# Altium schematic sheet ProPatch Main.SchDoc
size C; SheetNumber: 1; SheetTotal: 1
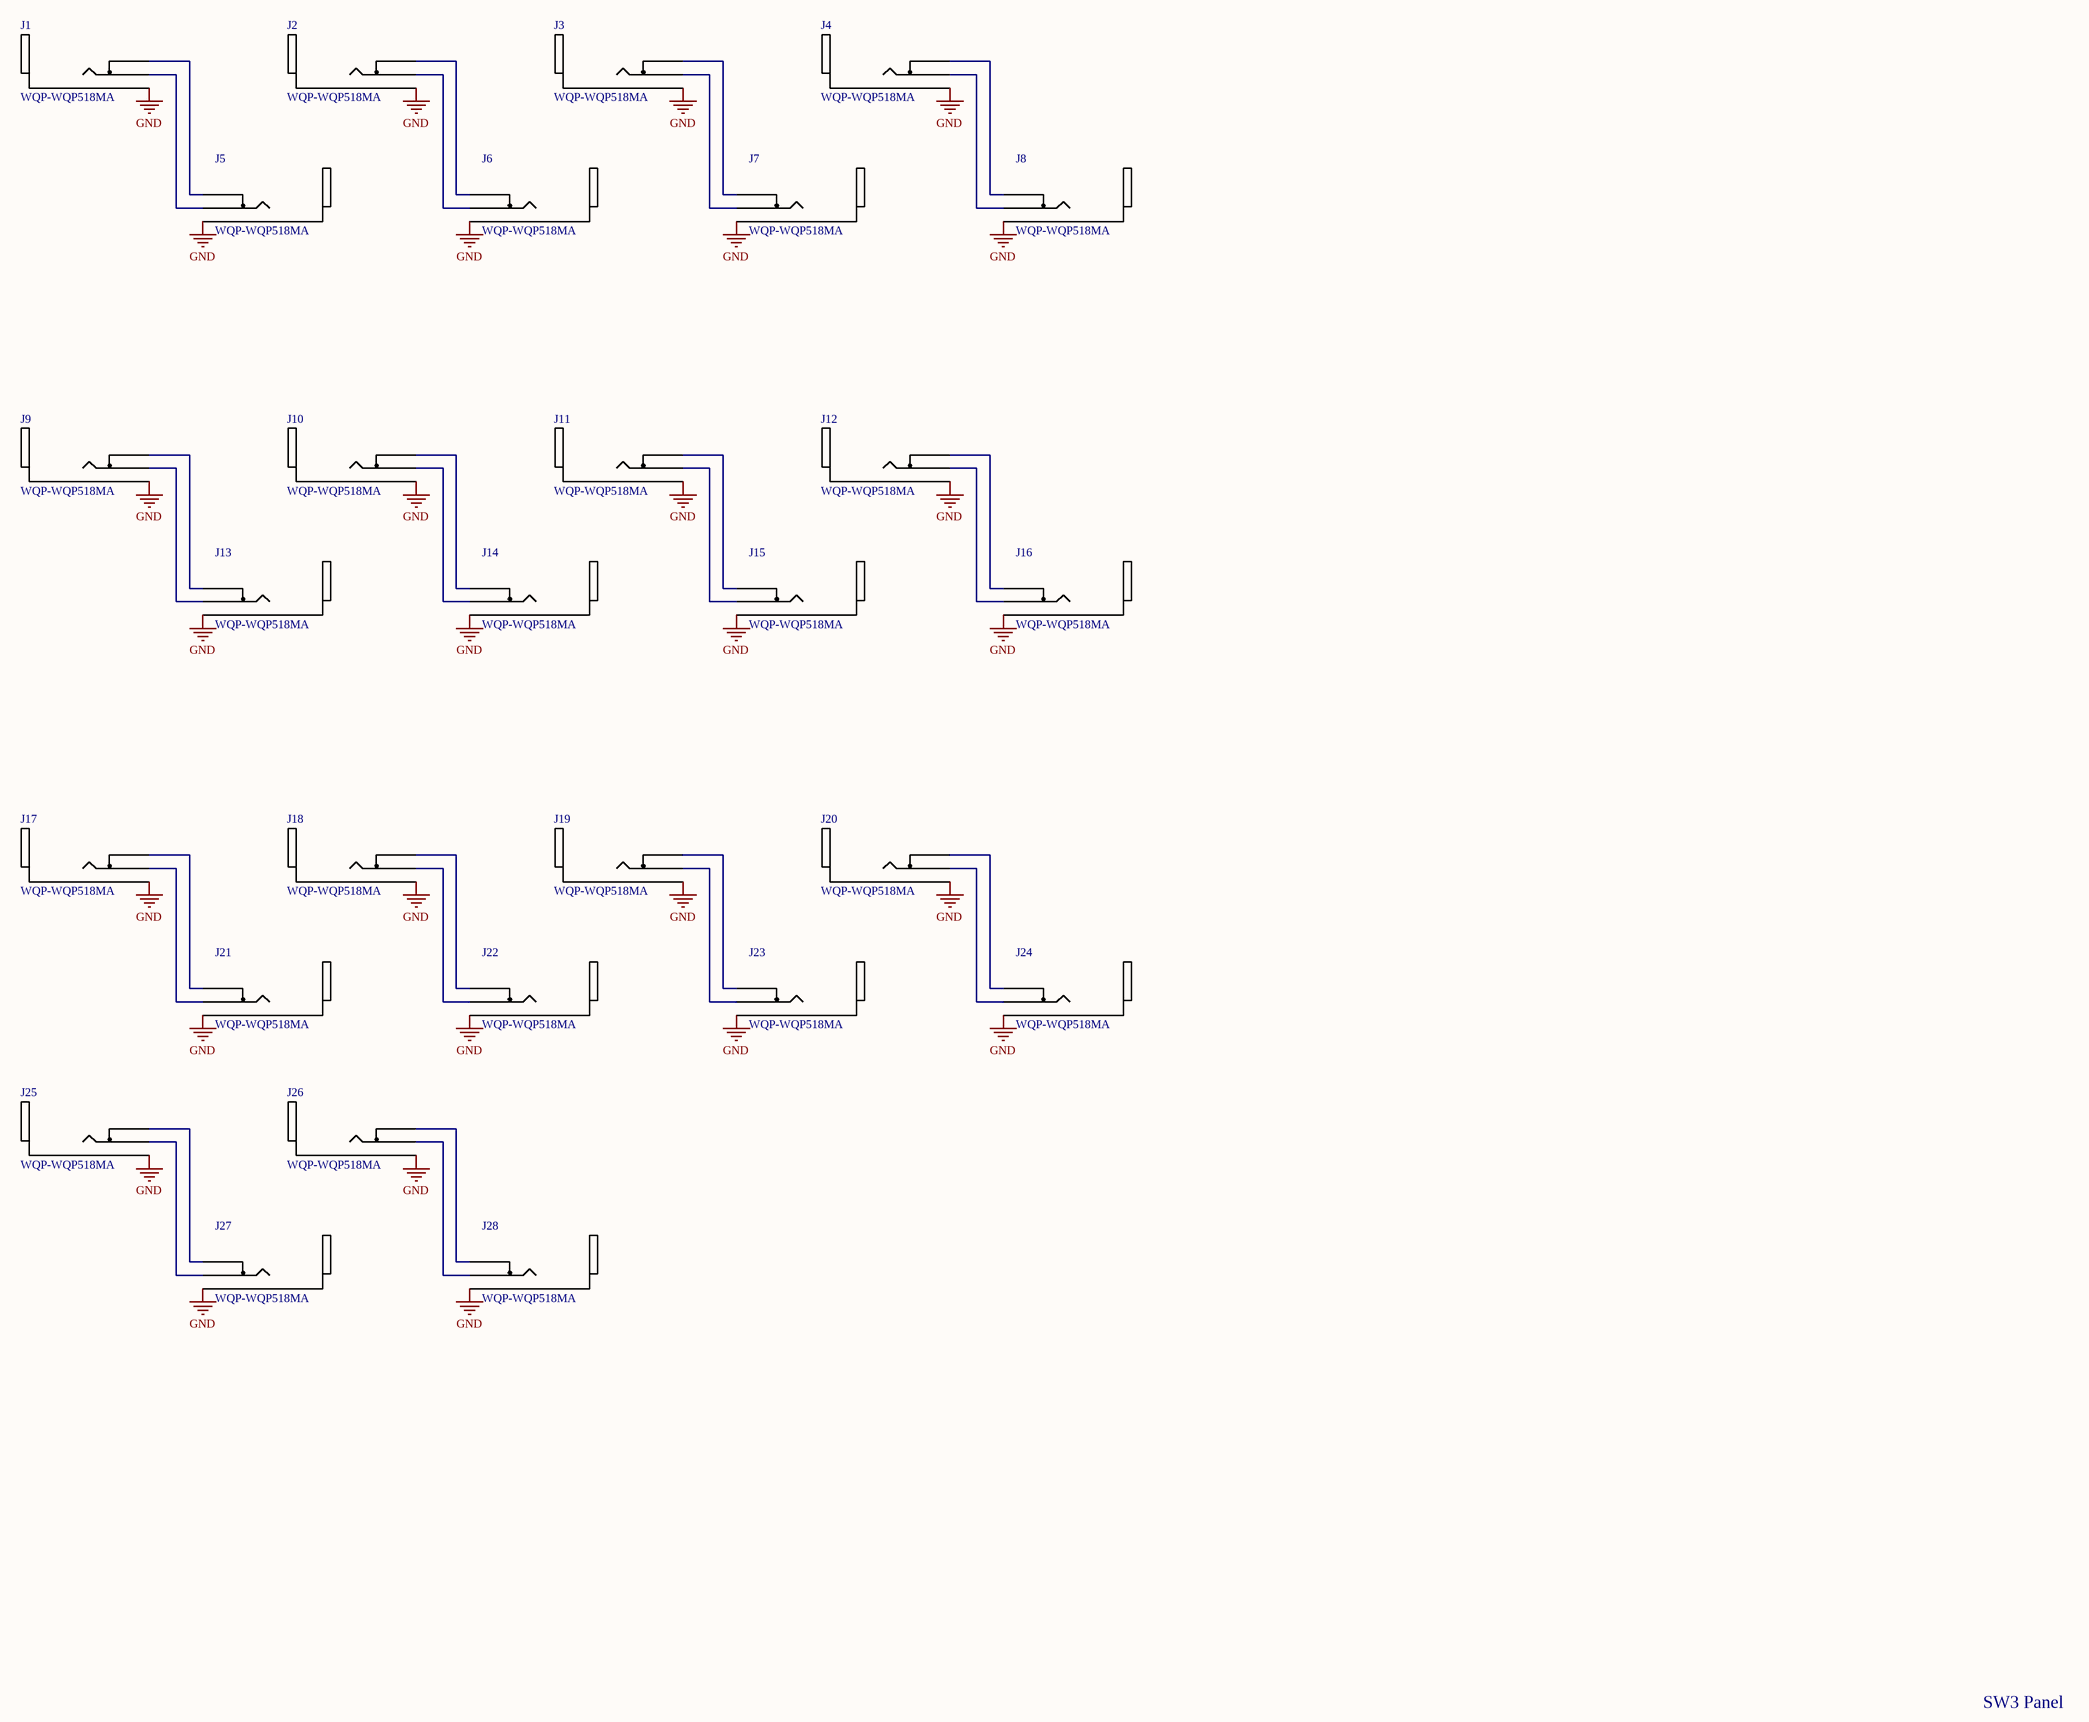
[diagram p0: ProPatch Main.SchDoc]

## Parts
J1  WQP-WQP518MA  [PJ301M-12]
J2  WQP-WQP518MA  [PJ301M-12]
J3  WQP-WQP518MA  [PJ301M-12]
J4  WQP-WQP518MA  [PJ301M-12]
J5  WQP-WQP518MA  [PJ301M-12]
J6  WQP-WQP518MA  [PJ301M-12]
J7  WQP-WQP518MA  [PJ301M-12]
J8  WQP-WQP518MA  [PJ301M-12]
J9  WQP-WQP518MA  [PJ301M-12]
J10  WQP-WQP518MA  [PJ301M-12]
J11  WQP-WQP518MA  [PJ301M-12]
J12  WQP-WQP518MA  [PJ301M-12]
J13  WQP-WQP518MA  [PJ301M-12]
J14  WQP-WQP518MA  [PJ301M-12]
J15  WQP-WQP518MA  [PJ301M-12]
J16  WQP-WQP518MA  [PJ301M-12]
J17  WQP-WQP518MA  [PJ301M-12]
J18  WQP-WQP518MA  [PJ301M-12]
J19  WQP-WQP518MA  [PJ301M-12]
J20  WQP-WQP518MA  [PJ301M-12]
J21  WQP-WQP518MA  [PJ301M-12]
J22  WQP-WQP518MA  [PJ301M-12]
J23  WQP-WQP518MA  [PJ301M-12]
J24  WQP-WQP518MA  [PJ301M-12]
J25  WQP-WQP518MA  [PJ301M-12]
J26  WQP-WQP518MA  [PJ301M-12]
J27  WQP-WQP518MA  [PJ301M-12]
J28  WQP-WQP518MA  [PJ301M-12]

## Nets
GND: J1.1 J2.1 J3.1 J4.1 J5.1 J6.1 J7.1 J8.1 J9.1 J10.1 J11.1 J12.1 J13.1 J14.1 J15.1 J16.1 J17.1 J18.1 J19.1 J20.1 J21.1 J22.1 J23.1 J24.1 J25.1 J26.1 J27.1 J28.1
NetJ1_2: J1.2 J5.2
NetJ1_3: J1.3 J5.3
NetJ2_2: J2.2 J6.2
NetJ2_3: J2.3 J6.3
NetJ3_2: J3.2 J7.2
NetJ3_3: J3.3 J7.3
NetJ4_2: J4.2 J8.2
NetJ4_3: J4.3 J8.3
NetJ9_2: J9.2 J13.2
NetJ9_3: J9.3 J13.3
NetJ10_2: J10.2 J14.2
NetJ10_3: J10.3 J14.3
NetJ11_2: J11.2 J15.2
NetJ11_3: J11.3 J15.3
NetJ12_2: J12.2 J16.2
NetJ12_3: J12.3 J16.3
NetJ17_2: J17.2 J21.2
NetJ17_3: J17.3 J21.3
NetJ18_2: J18.2 J22.2
NetJ18_3: J18.3 J22.3
NetJ19_2: J19.2 J23.2
NetJ19_3: J19.3 J23.3
NetJ20_2: J20.2 J24.2
NetJ20_3: J20.3 J24.3
NetJ25_2: J25.2 J27.2
NetJ25_3: J25.3 J27.3
NetJ26_2: J26.2 J28.2
NetJ26_3: J26.3 J28.3

## Notes on the sheet
- SW3 Panel
- Title:
- This work is licensed under a Creative Commons Attribution 4.0 International License. Derivative works should remove all Sophistry branding and ‘é’ watermark.
- Date:
- Engineer:
- Revision:
- Codename:
- Time:
- Variant:
- Sheet
- of

## Library data of the parts
J1-J28 = WQP-WQP518MA: CONN 3.5mm VIRTICAL MONO w/ NORMAL; Manufacturer: QingPu; PartNumber: WQP-WQP518MA; HelpURL: http://www.qingpu-electronics.com/en/products/WQP-PJ398SM-362.html; Supplier 1: QingPu; Supplier Part Number 1: WQP-WQP518MA; Manufacturer Part Number: WQP-WQP518MA